# EAGLE design S203X (EAGLE 6.6.0)
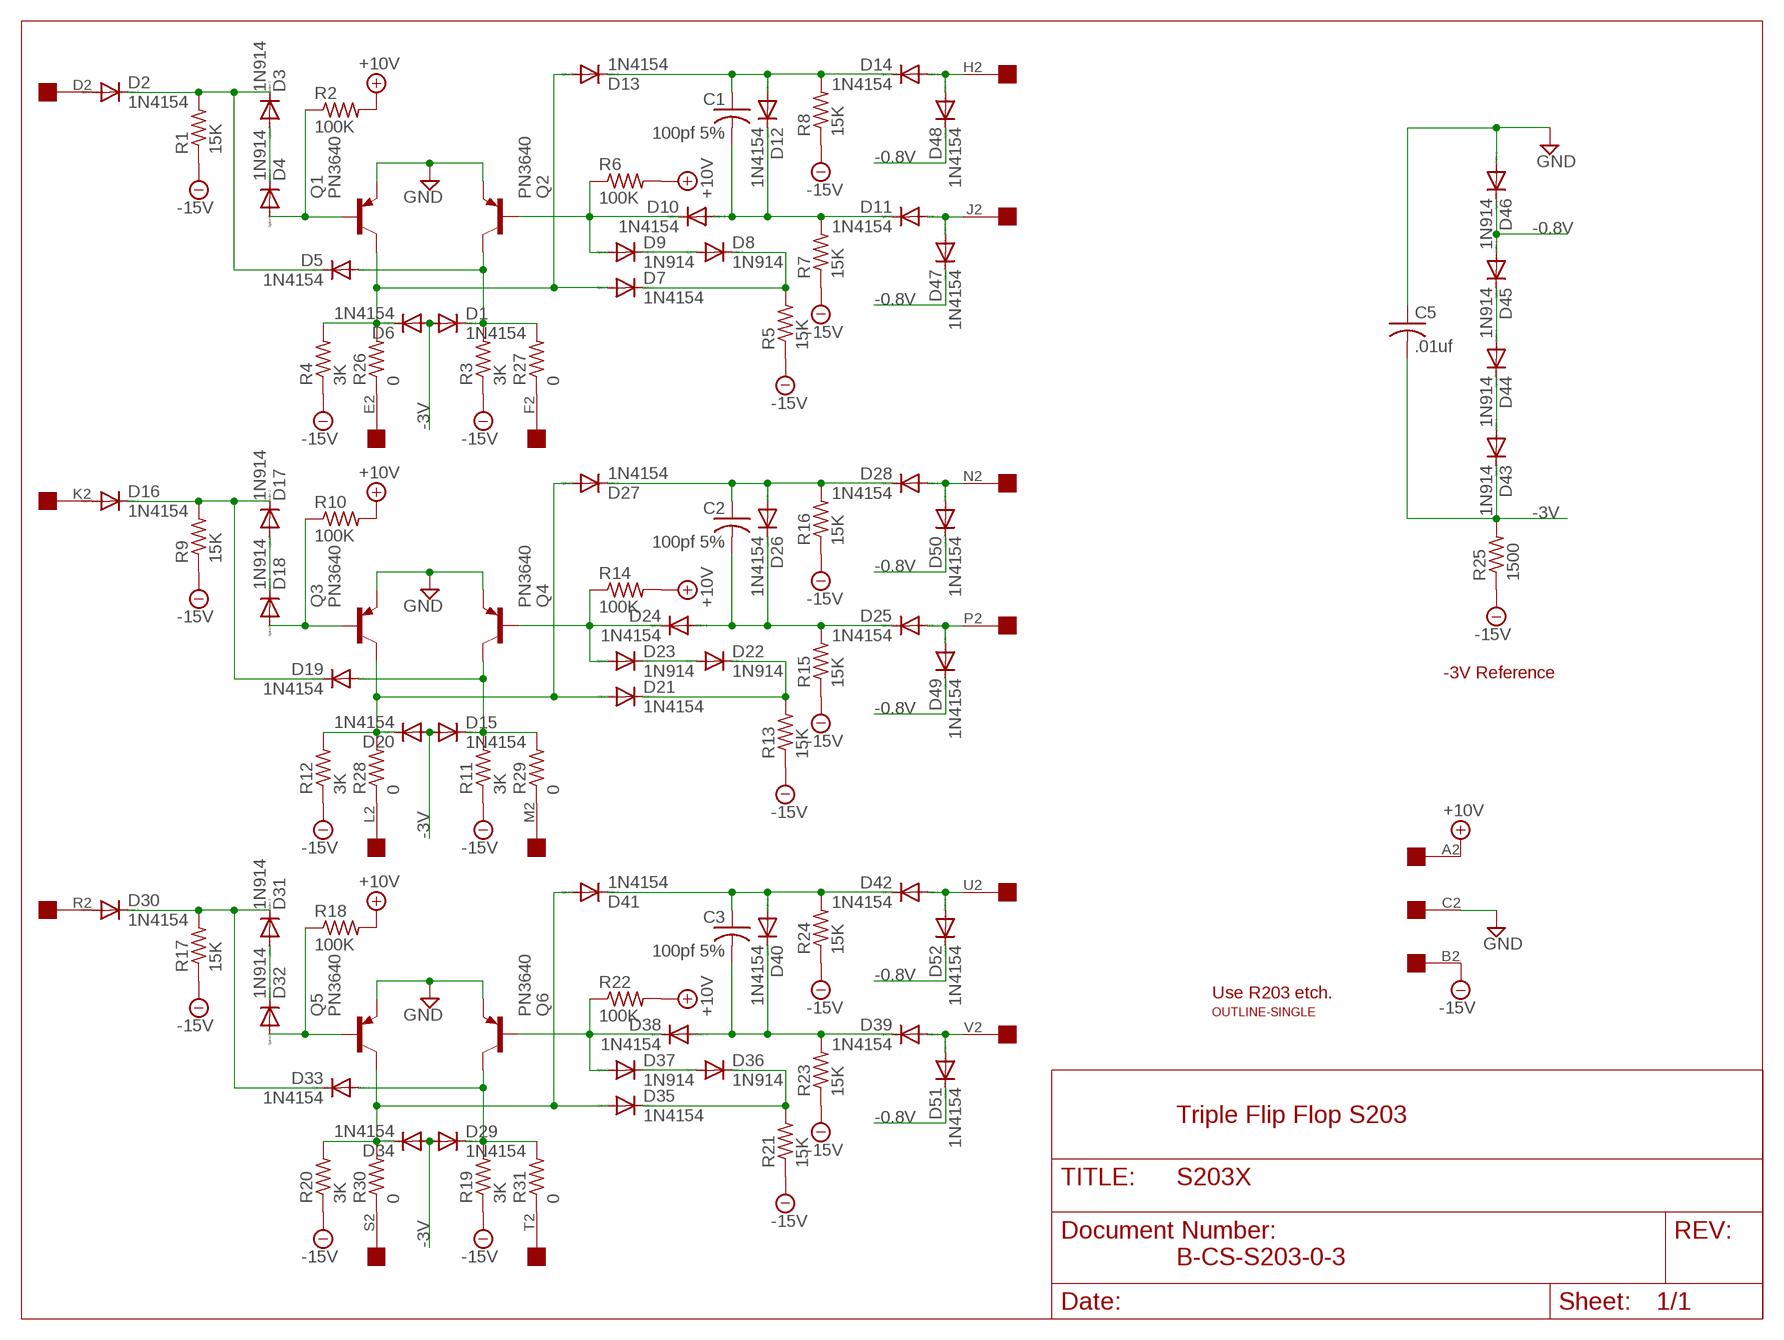
[diagram p0: schematic, sheet 1]

## Parts
C1  100pf 5%  C-US050-025X075  [C050-025X075]
C2  100pf 5%  C-US050-025X075  [C050-025X075]
C3  100pf 5%  C-US050-025X075  [C050-025X075]
C5  .01uf  C-US050-025X075  [C050-025X075]
D1  1N4154  1N4148DO35-10  [DO35-10]
D2  1N4154  1N4148DO35-10  [DO35-10]
D3  1N914  1N4148DO35-10  [DO35-10]
D4  1N914  1N4148DO35-10  [DO35-10]
D5  1N4154  1N4148DO35-10  [DO35-10]
D6  1N4154  1N4148DO35-10  [DO35-10]
D7  1N4154  1N4148DO35-10  [DO35-10]
D8  1N914  1N4148DO35-10  [DO35-10]
D9  1N914  1N4148DO35-10  [DO35-10]
D10  1N4154  1N4148DO35-10  [DO35-10]
D11  1N4154  1N4148DO35-10  [DO35-10]
D12  1N4154  1N4148DO35-10  [DO35-10]
D13  1N4154  1N4148DO35-10  [DO35-10]
D14  1N4154  1N4148DO35-10  [DO35-10]
D15  1N4154  1N4148DO35-10  [DO35-10]
D16  1N4154  1N4148DO35-10  [DO35-10]
D17  1N914  1N4148DO35-10  [DO35-10]
D18  1N914  1N4148DO35-10  [DO35-10]
D19  1N4154  1N4148DO35-10  [DO35-10]
D20  1N4154  1N4148DO35-10  [DO35-10]
D21  1N4154  1N4148DO35-10  [DO35-10]
D22  1N914  1N4148DO35-10  [DO35-10]
D23  1N914  1N4148DO35-10  [DO35-10]
D24  1N4154  1N4148DO35-10  [DO35-10]
D25  1N4154  1N4148DO35-10  [DO35-10]
D26  1N4154  1N4148DO35-10  [DO35-10]
D27  1N4154  1N4148DO35-10  [DO35-10]
D28  1N4154  1N4148DO35-10  [DO35-10]
D29  1N4154  1N4148DO35-10  [DO35-10]
D30  1N4154  1N4148DO35-10  [DO35-10]
D31  1N914  1N4148DO35-10  [DO35-10]
D32  1N914  1N4148DO35-10  [DO35-10]
D33  1N4154  1N4148DO35-10  [DO35-10]
D34  1N4154  1N4148DO35-10  [DO35-10]
D35  1N4154  1N4148DO35-10  [DO35-10]
D36  1N914  1N4148DO35-10  [DO35-10]
D37  1N914  1N4148DO35-10  [DO35-10]
D38  1N4154  1N4148DO35-10  [DO35-10]
D39  1N4154  1N4148DO35-10  [DO35-10]
D40  1N4154  1N4148DO35-10  [DO35-10]
D41  1N4154  1N4148DO35-10  [DO35-10]
D42  1N4154  1N4148DO35-10  [DO35-10]
D43  1N914  1N4148DO35-10  [DO35-10]
D44  1N914  1N4148DO35-10  [DO35-10]
D45  1N914  1N4148DO35-10  [DO35-10]
D46  1N914  1N4148DO35-10  [DO35-10]
D47  1N4154  1N4148DO35-10  [DO35-10]
D48  1N4154  1N4148DO35-10  [DO35-10]
D49  1N4154  1N4148DO35-10  [DO35-10]
D50  1N4154  1N4148DO35-10  [DO35-10]
D51  1N4154  1N4148DO35-10  [DO35-10]
D52  1N4154  1N4148DO35-10  [DO35-10]
Q1  PN3640  2N3637  [TO39]
Q2  PN3640  2N3637  [TO39]
Q3  PN3640  2N3637  [TO39]
Q4  PN3640  2N3637  [TO39]
Q5  PN3640  2N3637  [TO39]
Q6  PN3640  2N3637  [TO39]
R1  15K  R-US_0207/10  [0207/10]
R2  100K  R-US_0207/10  [0207/10]
R3  3K  R-US_0207/10  [0207/10]
R4  3K  R-US_0207/10  [0207/10]
R5  15K  R-US_0207/10  [0207/10]
R6  100K  R-US_0207/10  [0207/10]
R7  15K  R-US_0207/10  [0207/10]
R8  15K  R-US_0207/10  [0207/10]
R9  15K  R-US_0207/10  [0207/10]
R10  100K  R-US_0207/10  [0207/10]
R11  3K  R-US_0207/10  [0207/10]
R12  3K  R-US_0207/10  [0207/10]
R13  15K  R-US_0207/10  [0207/10]
R14  100K  R-US_0207/10  [0207/10]
R15  15K  R-US_0207/10  [0207/10]
R16  15K  R-US_0207/10  [0207/10]
R17  15K  R-US_0207/10  [0207/10]
R18  100K  R-US_0207/10  [0207/10]
R19  3K  R-US_0207/10  [0207/10]
R20  3K  R-US_0207/10  [0207/10]
R21  15K  R-US_0207/10  [0207/10]
R22  100K  R-US_0207/10  [0207/10]
R23  15K  R-US_0207/10  [0207/10]
R24  15K  R-US_0207/10  [0207/10]
R25  1500  R-US_0207/10  [0207/10]
R26  0  R-US_0207/10  [0207/10]
R27  0  R-US_0207/10  [0207/10]
R28  0  R-US_0207/10  [0207/10]
R29  0  R-US_0207/10  [0207/10]
R30  0  R-US_0207/10  [0207/10]
R31  0  R-US_0207/10  [0207/10]
U$1  OUTLINE-SINGLE  [SINGLE]
U$2  EDGE-1  [EDGE-CON1]

## Nets
+10V [Power]: R2.2 R6.2 R10.2 R14.2 R18.2 R22.2 U$2.A2
-0.8V: D45.A D46.C D47.C D48.C D49.C D50.C D51.C D52.C
-3V [Power]: C5.2 D1.A D6.A D15.A D20.A D29.A D34.A D43.C R25.2
-15V [Power]: R1.1 R3.1 R4.1 R5.1 R7.1 R8.1 R9.1 R11.1 R12.1 R13.1 R15.1 R16.1 R17.1 R19.1 R20.1 R21.1 R23.1 R24.1 R25.1 U$2.B2
E: D6.C D7.A D13.A Q1.3(C) R4.2 R26.2
F: D1.C D5.A Q2.3(C) R3.2 R27.2
GND [Power]: C5.1 D46.A Q1.1(E) Q2.1(E) Q3.1(E) Q4.1(E) Q5.1(E) Q6.1(E) U$2.C2
L: D20.C D21.A D27.A Q3.3(C) R12.2 R28.2
M: D15.C D19.A Q4.3(C) R11.2 R29.2
N$1: D31.A D32.C
N$2: C1.1 D12.A D13.C D14.C R8.2
N$3: D30.C D31.C D33.C R17.2
N$4: D30.A U$2.R2
N$6: D8.A D9.C
N$7: D14.A D48.A U$2.H2
N$8: C1.2 D10.A D11.C D12.C R7.2
N$9: D2.C D3.C D5.C R1.2
N$10: D2.A U$2.D2
N$11: D11.A D47.A U$2.J2
N$12: D7.C D8.C R5.2
N$13: D44.A D45.C
N$14: D4.A Q1.2(B) R2.1
N$15: D32.A Q5.2(B) R18.1
N$16: D43.A D44.C
N$17: D9.A D10.C Q2.2(B) R6.1
N$18: C3.1 D40.A D41.C D42.C R24.2
N$19: D17.A D18.C
N$20: D36.A D37.C
N$21: D42.A D52.A U$2.U2
N$22: C3.2 D38.A D39.C D40.C R23.2
N$23: D3.A D4.C
N$24: D39.A D51.A U$2.V2
N$25: D16.C D17.C D19.C R9.2
N$26: D16.A U$2.K2
N$27: D18.A Q3.2(B) R10.1
N$28: C2.1 D26.A D27.C D28.C R16.2
N$29: D22.A D23.C
N$30: D28.A D50.A U$2.N2
N$31: C2.2 D24.A D25.C D26.C R15.2
N$32: D25.A D49.A U$2.P2
N$33: R26.1 U$2.E2
N$34: D23.A D24.C Q4.2(B) R14.1
N$35: D21.C D22.C R13.2
N$36: R27.1 U$2.F2
N$37: D37.A D38.C Q6.2(B) R22.1
N$38: R28.1 U$2.L2
N$39: R29.1 U$2.M2
N$41: D35.C D36.C R21.2
N$42: R30.1 U$2.S2
N$43: R31.1 U$2.T2
S: D34.C D35.A D41.A Q5.3(C) R20.2 R30.2
T: D29.C D33.A Q6.3(C) R19.2 R31.2

## Notes on the sheet
- -3V Reference
- Use R203 etch.
- Triple Flip Flop S203
- B-CS-S203-0-3

## Library data of the parts
C1-C3 C5 = rcl:C-US: CAPACITOR, American symbol
D1-D52 = diode:1N4148: DIODE high speed (Philips)
Q1-Q6 = transistor-pnp:2N3637*: PNP Transistror
R1-R31 = rcl:R-US_: RESISTOR, American symbol
U$1 = dec-con:OUTLINE-*: Board outlines for DEC boards.
U$2 = dec-con:EDGE-1: Single-Sided DEC Edge Connector -- (side 2)

## Net classes
1 Power: width 0.813 mm

## Board
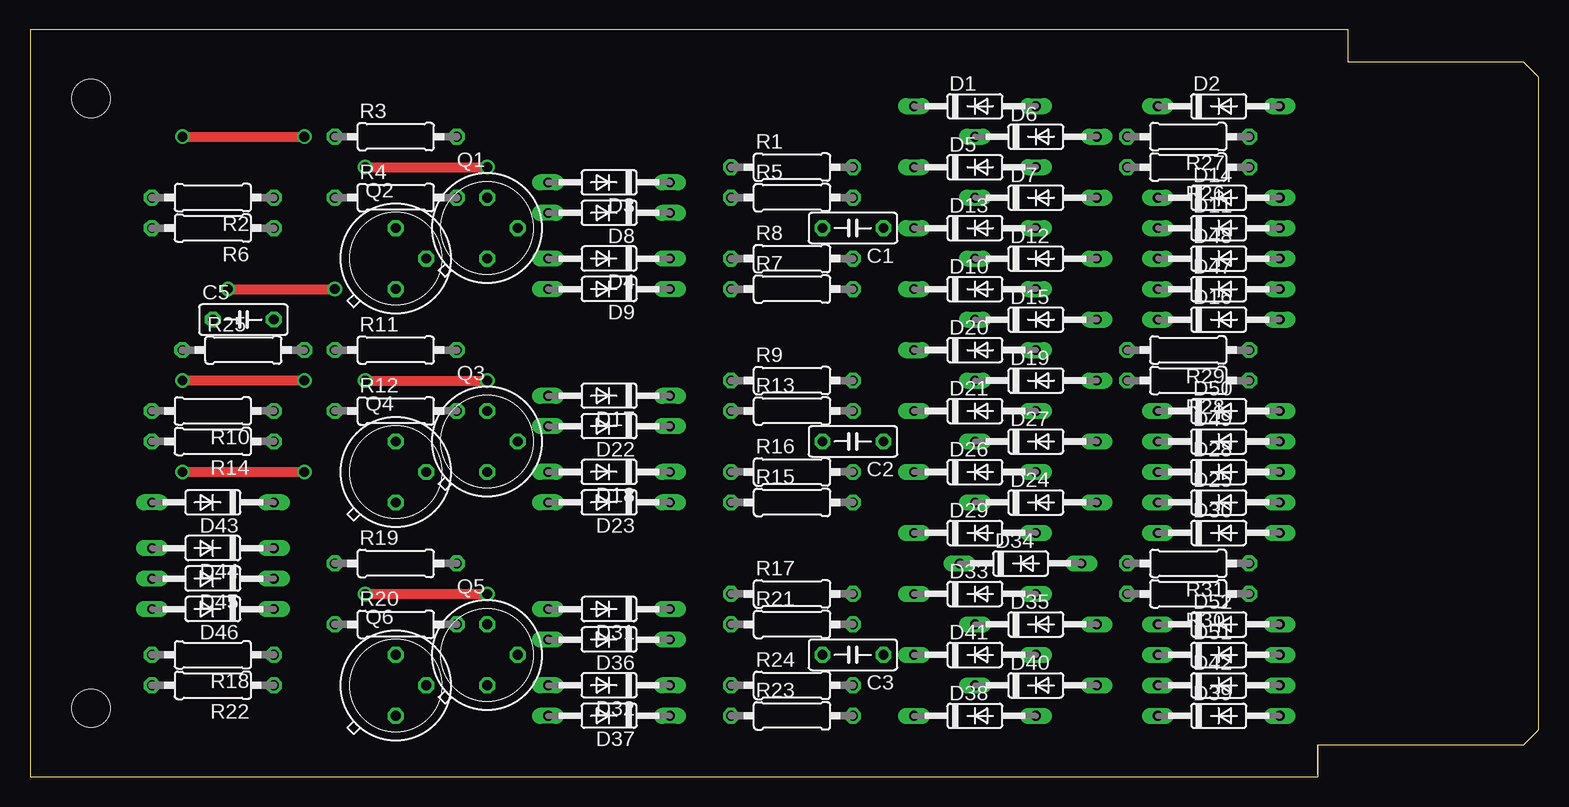
[diagram p1: board, top side]
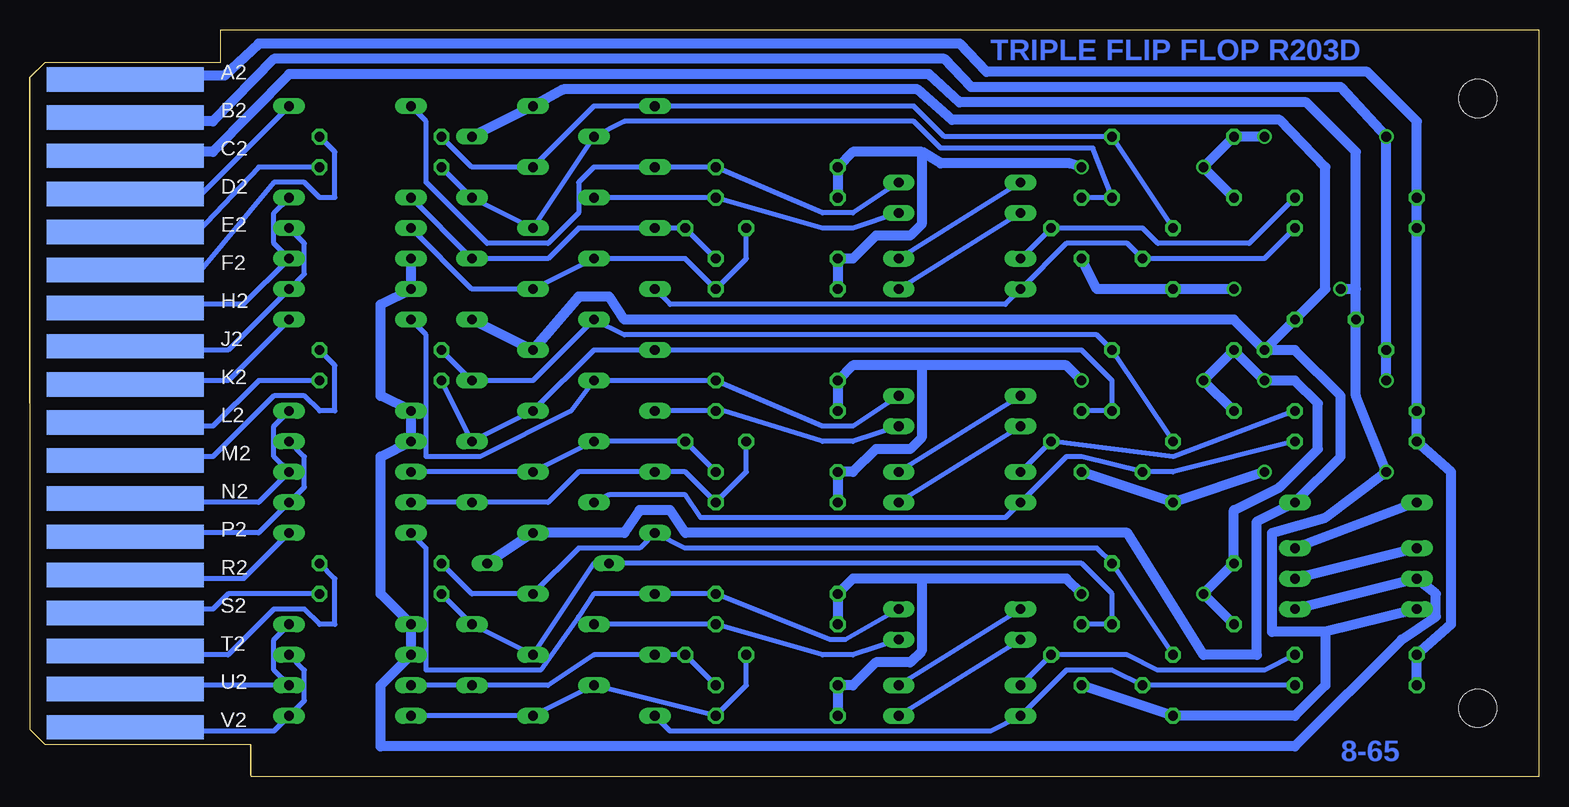
[diagram p2: board, bottom side, seen from below]

Size 125.73 x 62.23 mm. Coordinates in mm from the lower left corner, seen from the top.
Copper layers (1+16): Top 0.035mm / dielectric 1.5mm / Bottom 0.035mm
Design rules "16mils": minimum track width 16mil, minimum drill 32mil, track to track 15mil, track to pad 10mil, pad to pad 10mil, via to via 10mil, smd to smd 10mil, copper to edge 13mil, drill to drill 10mil, minimum pad ring 10mil, minimum via ring 8mil, stop-mask expansion 0mil, vias tented up to drill 0mil, thermal gap 10mil

### Footprints (pad centres in the part's own frame; a part is rotated, then mirrored left to right if it is on the bottom)
C050-025X075 = drill 0.813 octagon: 1 -2.54,0; 2 2.54,0
DO35-10 = drill 0.813 long: A 5.08,0; C -5.08,0
TO39 = drill 0.813 octagon: 1 0,-2.54; 2 2.54,0; 3 0,2.54
0207/10 = drill 0.813 octagon: 1 -5.08,0; 2 5.08,0
SINGLE = hole 3.175: 120.65,56.515; 120.65,5.715
EDGE-CON1 = smd 13.106 x 2.032 bottom: A2 7.938,4.128; B2 7.938,7.303; C2 7.938,10.477; D2 7.938,13.652; E2 7.938,16.828; F2 7.938,20.003; H2 7.938,23.177; J2 7.938,26.352; K2 7.938,29.527; L2 7.938,32.703; M2 7.938,35.877; N2 7.938,39.053; P2 7.938,42.227; R2 7.938,45.403; S2 7.938,48.578; T2 7.938,51.752; U2 7.938,54.928; V2 7.938,58.102

### Placement (x,y rotation side)
C1  68.58,45.72 180 top
C2  68.58,27.94 180 top
C3  68.58,10.16 180 top
C5  17.78,38.1 0 top
D1  78.74,55.88 0 top
D2  99.06,55.88 0 top
D3  48.26,49.53 180 top
D4  48.26,43.18 180 top
D5  78.74,50.8 0 top
D6  83.82,53.34 0 top
D7  83.82,48.26 0 top
D8  48.26,46.99 180 top
D9  48.26,40.64 180 top
D10  78.74,40.64 0 top
D11  99.06,45.72 0 top
D12  83.82,43.18 0 top
D13  78.74,45.72 0 top
D14  99.06,48.26 0 top
D15  83.82,38.1 0 top
D16  99.06,38.1 0 top
D17  48.26,31.75 180 top
D18  48.26,25.4 180 top
D19  83.82,33.02 0 top
D20  78.74,35.56 0 top
D21  78.74,30.48 0 top
D22  48.26,29.21 180 top
D23  48.26,22.86 180 top
D24  83.82,22.86 0 top
D25  99.06,22.86 0 top
D26  78.74,25.4 0 top
D27  83.82,27.94 0 top
D28  99.06,25.4 0 top
D29  78.74,20.32 0 top
D30  99.06,20.32 0 top
D31  48.26,13.97 180 top
D32  48.26,7.62 180 top
D33  78.74,15.24 0 top
D34  82.55,17.78 0 top
D35  83.82,12.7 0 top
D36  48.26,11.43 180 top
D37  48.26,5.08 180 top
D38  78.74,5.08 0 top
D39  99.06,5.08 0 top
D40  83.82,7.62 0 top
D41  78.74,10.16 0 top
D42  99.06,7.62 0 top
D43  15.24,22.86 180 top
D44  15.24,19.05 180 top
D45  15.24,16.51 180 top
D46  15.24,13.97 180 top
D47  99.06,40.64 0 top
D48  99.06,43.18 0 top
D49  99.06,27.94 0 top
D50  99.06,30.48 0 top
D51  99.06,10.16 0 top
D52  99.06,12.7 0 top
Q1  38.1,45.72 0 top
Q2  30.48,43.18 0 top
Q3  38.1,27.94 0 top
Q4  30.48,25.4 0 top
Q5  38.1,10.16 0 top
Q6  30.48,7.62 0 top
R1  63.5,50.8 0 top
R2  15.24,48.26 180 top
R3  30.48,53.34 0 top
R4  30.48,48.26 0 top
R5  63.5,48.26 0 top
R6  15.24,45.72 180 top
R7  63.5,40.64 0 top
R8  63.5,43.18 0 top
R9  63.5,33.02 0 top
R10  15.24,30.48 180 top
R11  30.48,35.56 0 top
R12  30.48,30.48 0 top
R13  63.5,30.48 0 top
R14  15.24,27.94 180 top
R15  63.5,22.86 0 top
R16  63.5,25.4 0 top
R17  63.5,15.24 0 top
R18  15.24,10.16 180 top
R19  30.48,17.78 0 top
R20  30.48,12.7 0 top
R21  63.5,12.7 0 top
R22  15.24,7.62 180 top
R23  63.5,5.08 0 top
R24  63.5,7.62 0 top
R25  17.78,35.56 0 top
R26  96.52,50.8 180 top
R27  96.52,53.34 180 top
R28  96.52,33.02 180 top
R29  96.52,35.56 180 top
R30  96.52,15.24 180 top
R31  96.52,17.78 180 top
U$1  125.73,62.23 180 top
U$2  125.73,62.23 180 top

### Tracks (layer width: path | path; a pad name or v marks a point on that pad's centre or on a via)
+10V
  Bottom 0.813: U$2.A2 112.65,58.04 111.76,58.42 109.54,58.42 106.68,61.09 48.26,61.09 46.04,58.74 14.29,58.74 10.16,54.61 R2.2 R6.2 R10.2 R14.2 7.3,25.4 7.3,12.7 R18.2 R22.2
-0.8V
  Bottom 0.813: D46.C D45.A 8.57,15.24 8.57,13.34 11.43,11.43 20.32,2.54 96.52,2.54 96.52,7.62 D51.C D52.C 96.52,15.24 96.52,26.67 D49.C D50.C 96.52,31.75 96.52,39.37 D47.C D48.C
-3V
  Bottom 0.813: R25.2 C5.2 17.78,40.64 17.78,50.8 21.59,54.74 48.9,54.74 51.75,57.28 81.28,57.28 D1.A D6.A | R25.2 20.32,35.56 16.51,31.75 16.51,26.67 D43.C 23.5,21.27 23.5,10.16 27.94,10.16 34.29,20.32 71.12,20.32 72.39,22.23 74.93,22.23 76.2,20.32 D29.A D34.A | R25.2 25.4,38.1 76.2,38.1 77.47,40.01 80.01,40.01 D20.A D15.A
-15V  (via drill 0.81)
  Top 0.813: v12.7,53.34 v22.86,53.34 | v27.94,50.8 v38.1,50.8 | v22.86,33.02 v12.7,33.02 | v27.94,33.02 v38.1,33.02 | v27.94,15.24 v38.1,15.24
  Bottom 0.813: U$2.B2 112.05,54.9 111.76,54.61 110.49,54.61 105.41,59.82 49.53,59.82 47.31,57.47 16.51,57.47 v12.7,53.34 R25.1 v12.7,33.02 | v22.86,53.34 R3.1 v27.94,50.8 R4.1 | v38.1,50.8 39.05,51.12 49.85,51.12 51.44,52.07 | 51.44,52.07 57.15,52.07 R1.1 R5.1 | R7.1 R8.1 57.15,43.18 55.24,45.09 52.39,45.09 51.44,46.04 51.44,52.07 | R12.1 v27.94,33.02 R11.1 v22.86,33.02 20.32,33.02 18.41,31.11 18.41,27.3 21.59,24.13 25.4,22.23 R19.1 v27.94,15.24 R20.1 | v38.1,33.02 39.37,34.29 51.44,34.29 | 51.44,34.29 57.15,34.29 R9.1 R13.1 | R15.1 R16.1 57.15,25.4 55.24,27.3 52.39,27.3 51.44,28.26 51.44,34.29 | R21.1 R17.1 57.15,16.51 51.44,16.51 | v38.1,15.24 39.37,16.51 51.44,16.51 | R23.1 R24.1 57.15,7.62 55.24,9.53 52.39,9.53 51.44,10.48 51.44,16.51
E
  Bottom 0.406: Q1.3 R4.2 37.15,52.39 49.85,52.39 52.07,54.61 76.2,54.61 D6.C D13.A D7.A R26.2
F
  Bottom 0.406: Q2.3 R3.2 49.53,53.34 52.07,55.88 D1.C 78.74,55.88 D5.A 88.9,50.8 R27.2
GND  (via drill 0.81)
  Top 0.813: v16.51,40.64 v25.4,40.64 | v12.7,25.4 v22.86,25.4
  Bottom 0.813: U$2.C2 112.09,51.74 111.76,52.07 110.49,52.07 104.14,58.55 50.8,58.55 48.26,56.2 19.37,56.2 15.24,52.07 15.24,40.64 | 15.24,40.64 C5.1 15.24,31.75 v12.7,25.4 17.78,21.59 22.23,20.32 22.23,12.06 17.78,12.06 | Q1.1 36.83,40.64 Q2.1 v25.4,40.64 | 15.24,40.64 v16.51,40.64 | Q3.1 Q4.1 v22.86,25.4 | D46.A 17.78,12.06 | 17.78,12.06 17.78,7.62 20.32,5.08 Q6.1 Q5.1
L
  Bottom 0.406: Q3.3 R12.2 35.56,33.02 38.1,35.56 D20.C 78.74,35.56 D21.A D27.A R28.2
M
  Bottom 0.406: Q4.3 R11.2 36.83,36.83 76.2,36.83 D15.C 83.82,33.02 D19.A R29.2
N$1
  Bottom 0.406: D31.A D32.C
N$2
  Bottom 0.406: R8.2 C1.1 D13.C 80.01,45.72 82.55,43.18 D12.A D14.C
N$3
  Bottom 0.406: D31.C 57.78,11.43 59.05,11.43 R17.2 D33.C 78.74,15.24 80.01,13.34 83.19,8.89 92.71,8.89 92.71,19.05 D30.C
N$4
  Bottom 0.406: U$2.R2 112.09,16.84 111.76,16.51 107.95,16.51 D30.A
N$6
  Bottom 0.406: D8.A D9.C
N$7
  Bottom 0.406: U$2.H2 112.09,39.04 111.76,39.37 107.95,39.37 D48.A 105.41,44.45 105.41,46.99 D14.A
N$8
  Bottom 0.406: C1.2 66.04,43.18 R7.2 71.12,43.18 D12.C D10.A 88.9,40.64 D11.C
N$9
  Bottom 0.406: D3.C 57.15,46.99 59.69,46.99 R1.2 D5.C 78.74,50.8 80.01,49.53 80.01,46.99 82.55,44.45 87.63,44.45 92.71,49.53 92.71,54.61 D2.C
N$10
  Bottom 0.406: U$2.D2 112.06,48.56 111.76,48.26 D2.A
N$11
  Bottom 0.406: U$2.J2 112.09,35.89 111.76,35.56 109.22,35.56 D47.A 102.87,41.91 102.87,44.45 D11.A
N$12
  Bottom 0.406: D8.C 57.15,45.72 59.69,45.72 R5.2 D7.C
N$13
  Bottom 0.813: D44.A D45.C
N$14
  Bottom 0.406: R2.1 24.13,44.45 31.75,44.45 33.02,45.72 Q1.2 D4.A
N$15
  Bottom 0.406: R18.1 22.86,8.89 31.75,8.89 34.29,10.16 Q5.2 D32.A
N$16
  Bottom 0.813: D43.A D44.C
N$17
  Bottom 0.406: R6.1 22.86,43.18 Q2.2 34.29,44.45 39.37,44.45 D9.A 44.45,39.37 72.39,39.37 D10.C
N$18
  Bottom 0.406: R24.2 C3.1 D41.C 78.74,10.16 82.55,7.62 D40.A D42.C
N$19
  Bottom 0.406: D17.A D18.C
N$20
  Bottom 0.406: D36.A D37.C
N$21
  Bottom 0.406: U$2.U2 112.12,7.26 111.76,7.62 D42.A 105.41,8.89 105.41,11.43 D52.A
N$22
  Bottom 0.406: C3.2 66.04,7.62 R23.2 D40.C D38.A D39.C
N$23
  Bottom 0.406: D3.A D4.C
N$24
  Bottom 0.406: U$2.V2 111.76,4.13 111.76,3.81 105.41,3.81 D39.A 102.87,6.35 102.87,8.89 D51.A
N$25
  Bottom 0.406: D17.C 57.15,29.21 59.69,29.21 R9.2 D19.C 80.64,30.48 88.27,26.67 92.71,26.67 92.71,36.83 D16.C
N$26
  Bottom 0.406: U$2.K2 112.06,32.72 111.76,33.02 109.22,33.02 D16.A
N$27
  Bottom 0.406: R10.1 30.48,26.67 Q3.2 D18.A
N$28
  Bottom 0.406: R16.2 C2.1 D27.C D26.A D28.C
N$29
  Bottom 0.406: D22.A D23.C
N$30
  Bottom 0.406: U$2.N2 112.09,23.19 111.76,22.86 106.68,22.86 D28.A 105.41,26.67 105.41,29.21 D50.A
N$31
  Bottom 0.406: C2.2 66.04,25.4 R15.2 71.12,25.4 D26.C 80.01,25.4 82.55,22.86 D24.A D25.C
N$32
  Bottom 0.406: U$2.P2 112.09,19.99 111.76,20.32 106.68,20.32 D25.A 102.87,24.13 102.87,26.67 D49.A
N$33
  Bottom 0.406: U$2.E2 111.77,45.39 106.68,50.8 R26.1
N$34
  Bottom 0.406: R14.1 30.48,25.4 Q4.2 38.1,26.67 39.37,26.67 D23.A 44.45,21.59 69.85,21.59 71.12,23.5 77.47,23.5 D24.C
N$35
  Bottom 0.406: D22.C 57.15,27.94 59.69,27.94 67.94,30.48 R13.2 D21.C
N$36
  Bottom 0.406: U$2.F2 112.04,42.19 111.76,41.91 105.41,49.53 102.87,49.53 101.6,48.26 100.33,48.26 100.33,52.07 R27.1
N$37
  Bottom 0.406: D38.C 72.39,3.81 45.72,3.81 D37.A 39.37,8.89 35.56,8.89 Q6.2 R22.1
N$38
  Bottom 0.406: U$2.L2 112.09,29.54 111.76,29.21 110.49,29.21 106.68,33.02 R28.1
N$39
  Bottom 0.406: U$2.M2 112.09,26.34 111.76,26.67 110.49,26.67 105.41,31.75 102.87,31.75 101.6,30.48 100.33,30.48 100.33,34.29 R29.1
N$41
  Bottom 0.406: D35.C R21.2 59.69,10.16 57.15,10.16 D36.C
N$42
  Bottom 0.406: U$2.S2 112.06,13.66 111.76,13.97 110.49,13.97 109.22,15.24 R30.1
N$43
  Bottom 0.406: U$2.T2 112.09,10.49 111.76,10.16 109.22,10.16 105.41,13.97 102.87,13.97 101.6,12.7 100.33,12.7 100.33,16.51 R31.1
S
  Bottom 0.406: R30.2 D35.A D41.A 78.74,17.78 D34.C 38.1,17.78 35.56,15.24 R20.2 Q5.3
T
  Bottom 0.406: R31.2 88.9,15.24 D33.A 80.01,19.05 74.93,19.05 D29.C 71.12,19.05 36.83,19.05 R19.2 Q6.3

### Text on the board
Bottom: TRIPLE FLIP FLOP R203D | 8-65